# Altium schematic sheet BNO080.SchDoc
size A
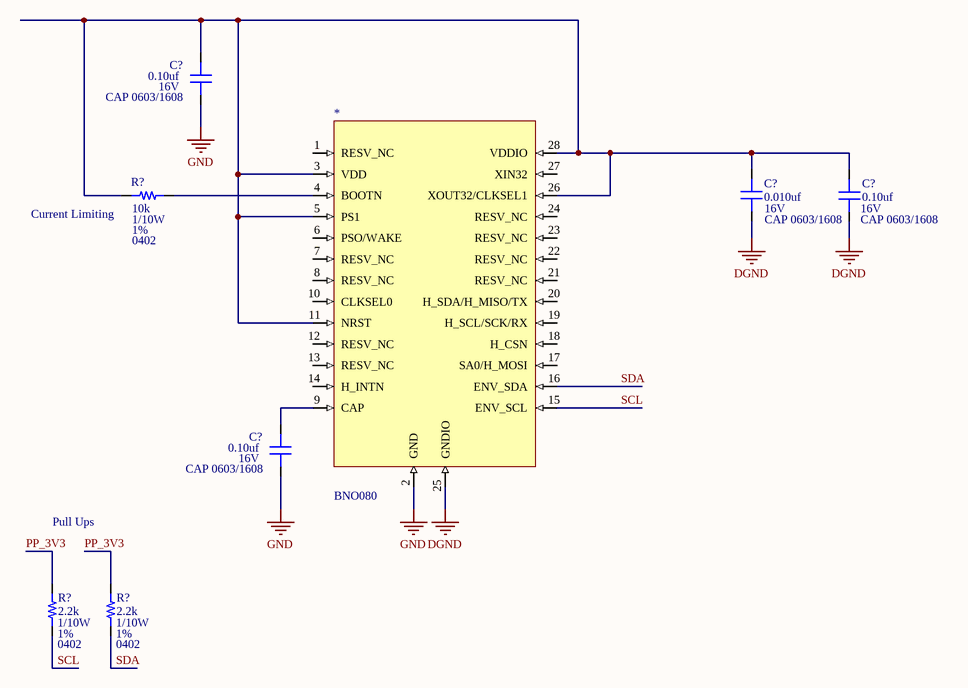
[diagram p0: BNO080.SchDoc]

## Parts
(Parts that share a designator on the sheet are numbered #1, #2 ... from top to bottom, then left to right.)
*  BNO080  [TFLGA-28]
C?#1  value 0.10uf  Voltage_Rating: 16V  [CAP 0603/1608]  (hidden comment: Capacitor MLCC 0.10uf 16V CAP 0603/1608)
C?#2  value 0.010uf  Voltage_Rating: 16V  [CAP 0603/1608]  (hidden comment: Capacitor MLCC 0.010uf 16V CAP 0603/1608)
C?#3  value 0.10uf  Voltage_Rating: 16V  [CAP 0603/1608]  (hidden comment: Capacitor MLCC 0.10uf 16V CAP 0603/1608)
C?#4  value 0.10uf  Voltage_Rating: 16V  [CAP 0603/1608]  (hidden comment: Capacitor MLCC 0.10uf 16V CAP 0603/1608)
R?#1  value 10k  Tolerance: 1%  Power: 1/10W  Package: 0402  [RES 0402/1005]  (hidden comment: Resistor 10k 0402 1/10W 1%)
R?#2  value 2.2k  Tolerance: 1%  Power: 1/10W  Package: 0402  [RES 0402/1005]  (hidden comment: Resistor 2.2k 0402 1/10W 1%)
R?#3  value 2.2k  Tolerance: 1%  Power: 1/10W  Package: 0402  [RES 0402/1005]  (hidden comment: Resistor 2.2k 0402 1/10W 1%)

## Nets
DGND: *.25(GNDIO) C?#2.1 C?#3.1
GND: *.2(GND) C?#1.1 C?#4.1
PP_3V3: R?#2.2 R?#3.2
SCL: *.15(ENV_SCL) R?#2.1
SDA: *.16(ENV_SDA) R?#3.1
Net*_3: *.3(VDD) *.5(PS1) *.11(NRST) *.26(XOUT32/CLKSEL1) *.28(VDDIO) C?#1.2 C?#2.2 C?#3.2 R?#1.1
Net*_4: *.4(BOOTN) R?#1.2
Net*_9: *.9(CAP) C?#4.2

Not connected (* = marked no-connect by the designer): * 1(RESV_NC) 6(PSO/WAKE) 7(RESV_NC) 8(RESV_NC) 10(CLKSEL0) 12(RESV_NC) 13(RESV_NC) 14(H_INTN) 17(SA0/H_MOSI) 18(H_CSN) 19(H_SCL/SCK/RX) 20(H_SDA/H_MISO/TX) 21(RESV_NC) 22(RESV_NC) 23(RESV_NC) 24(RESV_NC) 27(XIN32)

## Notes on the sheet
- (near R?#1) Current Limiting
- Pull Ups

## Library data of the parts
* = 33: Accelerometer, Gyroscope, Magnetometer, 9 Axis Sensor; Manufacturer_id: 1; idIC_Misc: 33; Value: Null; Vin(Min): 1.7V for IO, 2.4V for sensors; Vin(Max): 3.6V; MfrPartNo: BNO080; Drawer_id: 1; Name: BNO080; Type: 9dof IC Sensor; Protocol: Null; Num_Circuits: 1; Data_Rate: Null; Package: 28-TFLGA; ComponentLink1Description: datasheet; ComponentLink1URL: https://cdn.sparkfun.com/assets/1/3/4/5/9/BNO080_Datasheet_v1.3.pdf; Supplier1: Digi-Key; Supplier1PartNo: https://www.digikey.com/product-detail/en/hillcrest-laboratories-inc/BNO080/1888-1000-1-ND/7917169; Created_By: Null; Updated_By: Null
C?#1 C?#3 C?#4 = 223: Manufacturer_id: 1; idCapacitor: 223; Name: Cap_0.10uf_16V_CAP 0603/1608; Dielectric: Ceramic; Created_By: Nick Mah; Drawer_id: 1; Package: CAP 0603/1608; Created_Date: 10/20/2018
C?#2 = 217: Manufacturer_id: 1; idCapacitor: 217; Name: Cap_0.010uf_16V_CAP 0603/1608; Dielectric: Ceramic; Created_By: Nick Mah; Drawer_id: 1; Package: CAP 0603/1608; Created_Date: 10/20/2018
R?#1 = 97: Manufacturer_id: 1; idResistor: 97; Name: Res_10k_0402_1/10W_1%; Created_By: Nick Mah; Supplier 1: Digi-Key; Drawer_id: 1; ComponentLink1Description: Datasheet; Created_Date: 2018-10-20
R?#2 R?#3 = 81: Manufacturer_id: 1; idResistor: 81; Name: Res_2.2k_0402_1/10W_1%; Created_By: Nick Mah; Supplier 1: Digi-Key; Drawer_id: 1; ComponentLink1Description: Datasheet; Created_Date: 2018-10-20